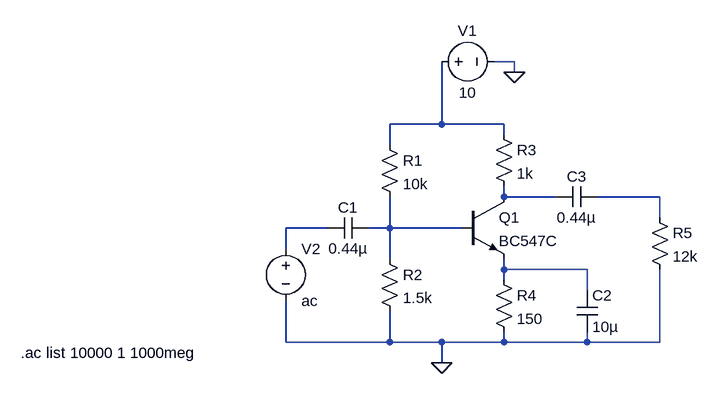
[diagram p0: schematic bjf_f_response.asc]
bjf_f_response.asc, the LTspice schematic file:
Version 4
SHEET 1 880 680
WIRE 384 -144 352 -144
WIRE 384 -128 384 -144
WIRE 272 -48 272 -144
WIRE 272 -48 192 -48
WIRE 368 -48 272 -48
WIRE 368 -32 368 -48
WIRE 192 -16 192 -48
WIRE 368 64 368 48
WIRE 448 64 368 64
WIRE 608 64 512 64
WIRE 608 96 608 64
WIRE 96 112 32 112
WIRE 192 112 192 64
WIRE 192 112 160 112
WIRE 304 112 192 112
WIRE 32 144 32 112
WIRE 192 160 192 112
WIRE 368 176 368 160
WIRE 496 176 368 176
WIRE 368 192 368 176
WIRE 496 208 496 176
WIRE 32 288 32 224
WIRE 192 288 192 240
WIRE 192 288 32 288
WIRE 272 288 192 288
WIRE 368 288 368 272
WIRE 368 288 272 288
WIRE 496 288 496 272
WIRE 496 288 368 288
WIRE 608 288 608 176
WIRE 608 288 496 288
WIRE 272 320 272 288
FLAG 272 320 0
FLAG 384 -128 0
SYMBOL cap 160 96 R90
WINDOW 0 0 32 VBottom 2
WINDOW 3 32 32 VTop 2
SYMATTR InstName C1
SYMATTR Value 0.44µ
SYMBOL res 176 -32 R0
SYMATTR InstName R1
SYMATTR Value 10k
SYMBOL res 176 144 R0
SYMATTR InstName R2
SYMATTR Value 1.5k
SYMBOL npn 304 64 R0
SYMATTR InstName Q1
SYMATTR Value BC547C
SYMBOL res 352 -48 R0
SYMATTR InstName R3
SYMATTR Value 1k
SYMBOL res 352 176 R0
SYMATTR InstName R4
SYMATTR Value 150
SYMBOL cap 480 208 R0
SYMATTR InstName C2
SYMATTR Value 10µ
SYMBOL cap 512 48 R90
WINDOW 0 0 32 VBottom 2
WINDOW 3 32 32 VTop 2
SYMATTR InstName C3
SYMATTR Value 0.44µ
SYMBOL res 592 80 R0
SYMATTR InstName R5
SYMATTR Value 12k
SYMBOL voltage 256 -144 R270
WINDOW 0 32 56 VTop 2
WINDOW 3 -32 56 VBottom 2
WINDOW 123 0 0 Left 2
WINDOW 39 0 0 Left 2
SYMATTR InstName V1
SYMATTR Value 10
SYMBOL voltage 32 128 R0
WINDOW 123 0 0 Left 2
WINDOW 39 0 0 Left 2
SYMATTR InstName V2
SYMATTR Value ac
TEXT -376 304 Left 2 !.ac list 10000 1 1000meg

The netlist it stands for:
* bjf_f_response.asc
C1 N005 N004 0.44µ
R1 N001 N005 10k
R2 N005 0 1.5k
Q1 N002 N005 N006 0 BC547C
R3 N001 N002 1k
R4 N006 0 150
C2 N006 0 10µ
C3 N003 N002 0.44µ
R5 N003 0 12k
V1 N001 0 10
V2 N004 0 ac
.model NPN NPN
.model PNP PNP
.lib standard.bjt
.ac list 10000 1 1000meg
.backanno
.end